# EAGLE schematic Emat (EAGLE 7.5.0)
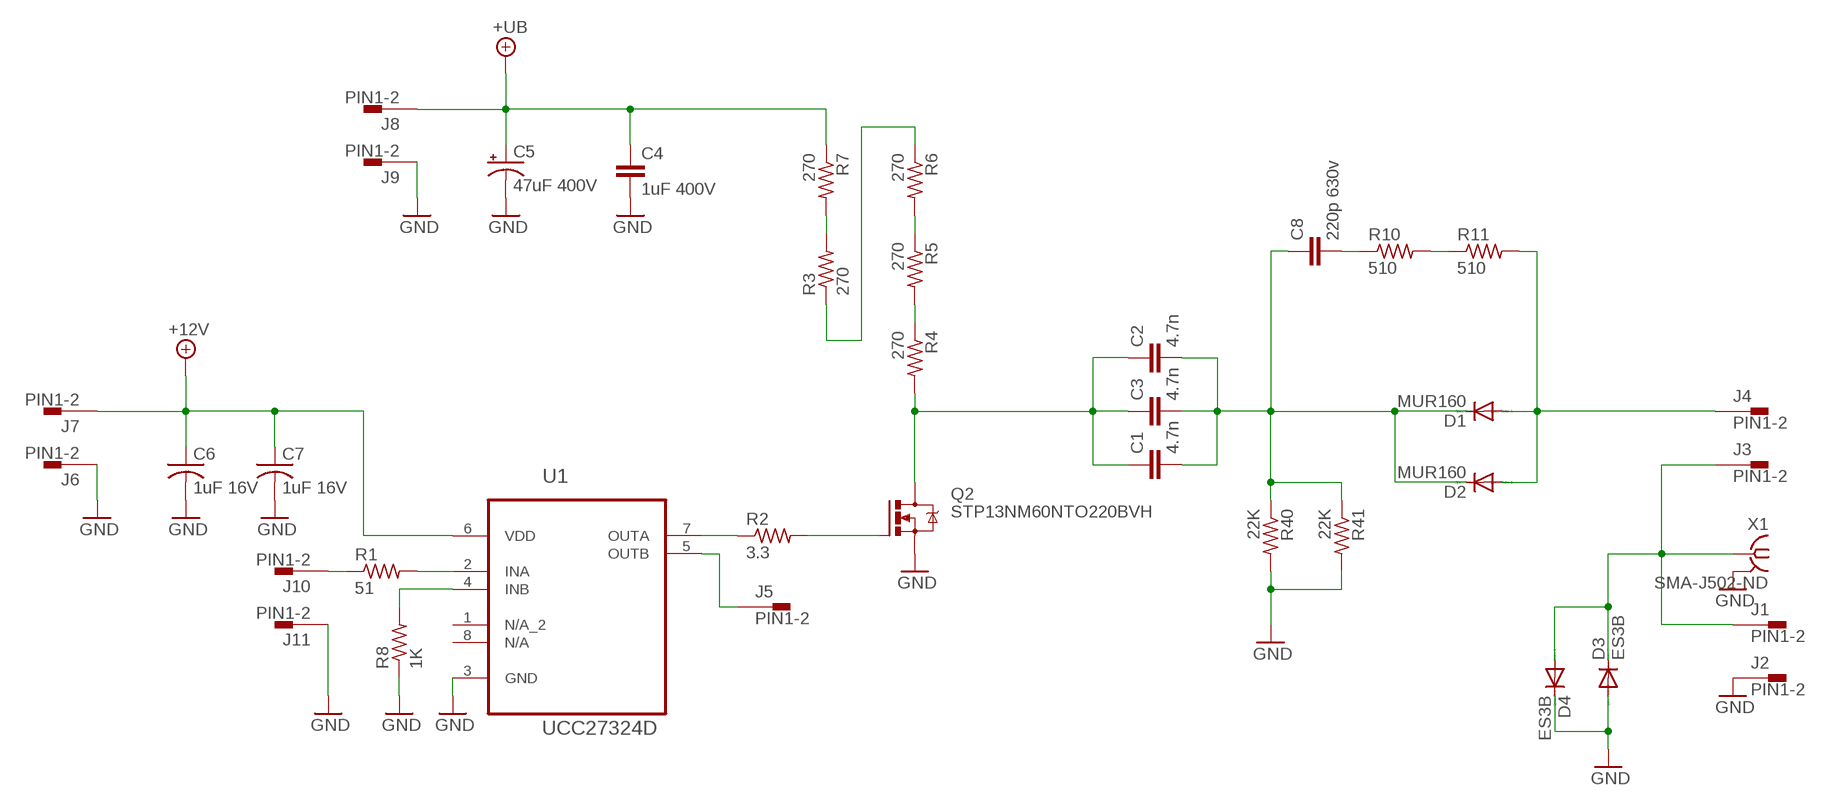
[diagram p0: schematic, sheet 1]

## Parts
C1  4.7n  C10/4  [C10B4]
C2  4.7n  C10/4  [C10B4]
C3  4.7n  C10/4  [C10B4]
C4  1uF 400V  C27/13  [C27.5B13]
C5  47uF 400V  CPOL-USSANYO_G  [SANYO-OSCON_G]
C6  1uF 16V  C-USC0805  [C0805]
C7  1uF 16V  C-USC0805  [C0805]
C8  220p 630v  C-EUC1206K  [C1206K]
D1  MUR160  [DO41-10]
D2  MUR160  [DO41-10]
D3  ES3B  DIODE-SMC  [SMC]
D4  ES3B  DIODE-SMC  [SMC]
J1  PIN1-2  [62221]
J2  PIN1-2  [62221]
J3  PIN1-2  [62221]
J4  PIN1-2  [62221]
J5  PIN1-2  [62221]
J6  PIN1-2  [62221]
J7  PIN1-2  [62221]
J8  PIN1-2  [62221]
J9  PIN1-2  [62221]
J10  PIN1-2  [62221]
J11  PIN1-2  [62221]
Q2  STP13NM60NTO220BVH  [TO220BVH]
R1  51  R-US_R1206  [R1206]
R2  3.3  R-US_R1206  [R1206]
R3  270  R-US_R2512  [R2512]
R4  270  R-US_R2512  [R2512]
R5  270  R-US_R2512  [R2512]
R6  270  R-US_R2512  [R2512]
R7  270  R-US_R2512  [R2512]
R8  1K  R-US_R1206  [R1206]
R10  510  R-US_R1206  [R1206]
R11  510  R-US_R1206  [R1206]
R40  22K  R-US_R2512  [R2512]
R41  22K  R-US_R2512  [R2512]
U1  UCC27324D  [SOIC127P600X175-8N]
X1  SMA-J502-ND  [J502-ND]

## Nets
+12V: C6.1 C7.1 J7.1 U1.6(VDD)
+UB: C4.1 C5.+ J8.1 R7.1
GND: C4.2 C5.- C6.2 C7.2 D3.A D4.C J2.1 J6.1 J9.1 J11.1 Q2.S R8.1 R40.2 R41.2 U1.3(GND) X1.2 X1.3 X1.4 X1.5
N$1: R1.2 U1.2(INA)
N$2: R2.1 U1.7(OUTA)
N$3: Q2.G R2.2
N$4: C1.1 C2.1 C3.1 Q2.D R4.2
N$5: J10.1 R1.1
N$6: R4.1 R5.2
N$7: R5.1 R6.2
N$8: R3.1 R6.1
N$9: R3.2 R7.2
N$10: D3.C D4.A J1.1 J3.1 X1.1
N$11: R8.2 U1.4(INB)
N$12: J5.1 U1.5(OUTB)
N$13: C8.2 R10.1
N$14: R10.2 R11.1
N$15: D1.A D2.A J4.1 R11.2
N$16: C1.2 C2.2 C3.2 C8.1 D1.C D2.C R40.1 R41.1
Unconnected: U1.1(N/A_2) U1.8(N/A)

## Library data of the parts
C1-C4 = capacitor-wima:C: CAPACITOR naming: grid - package width
C5 = rcl:CPOL-US: POLARIZED CAPACITOR, American symbol
C6 C7 = rcl:C-US: CAPACITOR, American symbol
C8 = rcl:C-EU: CAPACITOR, European symbol
D1 D2 = diode:MUR160: DIODE
D3 D4 = diode:DIODE-: DIODE
J1-J11 = con-faston:PIN1-2: CONN TAB FASTON BRASS .187 PCB TAB, FSSTON, DUAL STAKE, .187 SERIES Digi-Key Part Number: A24734CT-ND Source: Tyco Electronics Corporation .. ENG_CD_62221_R.pdf http://search.digikey.com/scripts/DkSearch/dksus.dll?Detail&name=A24734CT-ND; MF: TYCO ELECTRONICS; MPN: 62221-1; OC_FARNELL: unknown; OC_NEWARK: 16H2318
Q2 = transistor-power:STP13NM60N: N-CHANNEL MOS FET
R1 R2 R8 R10 R11 R40 R41 = rcl:R-US_: RESISTOR, American symbol
R3-R7 = resistor:R-US_: RESISTOR, American symbol
U1 = UCC27324D:UCC27324D: DUAL 4-A PEAK HIGH SPEED LOW- SIDE POWER MOSFET DRIVERS
X1 = con-coax:SMA-: SMA 50 Ohm End Launch Jack Receptacle - Round Contact Johnson Components Source: www.johnsoncomponents.com .. J502-ND.pdf; OC_FARNELL: unknown; OC_NEWARK: unknown